# Altium schematic sheet Sheet1.SchDoc: USB C current mode supply from 12V battery
size 431 x 279 mm; Revision: 1.0.0; SheetNumber: 1; SheetTotal: 1; ENG_APP_DATE: --/--/--; DSN_APP_DATE: --/--/--; CHK_APP_DATE: --/--/--
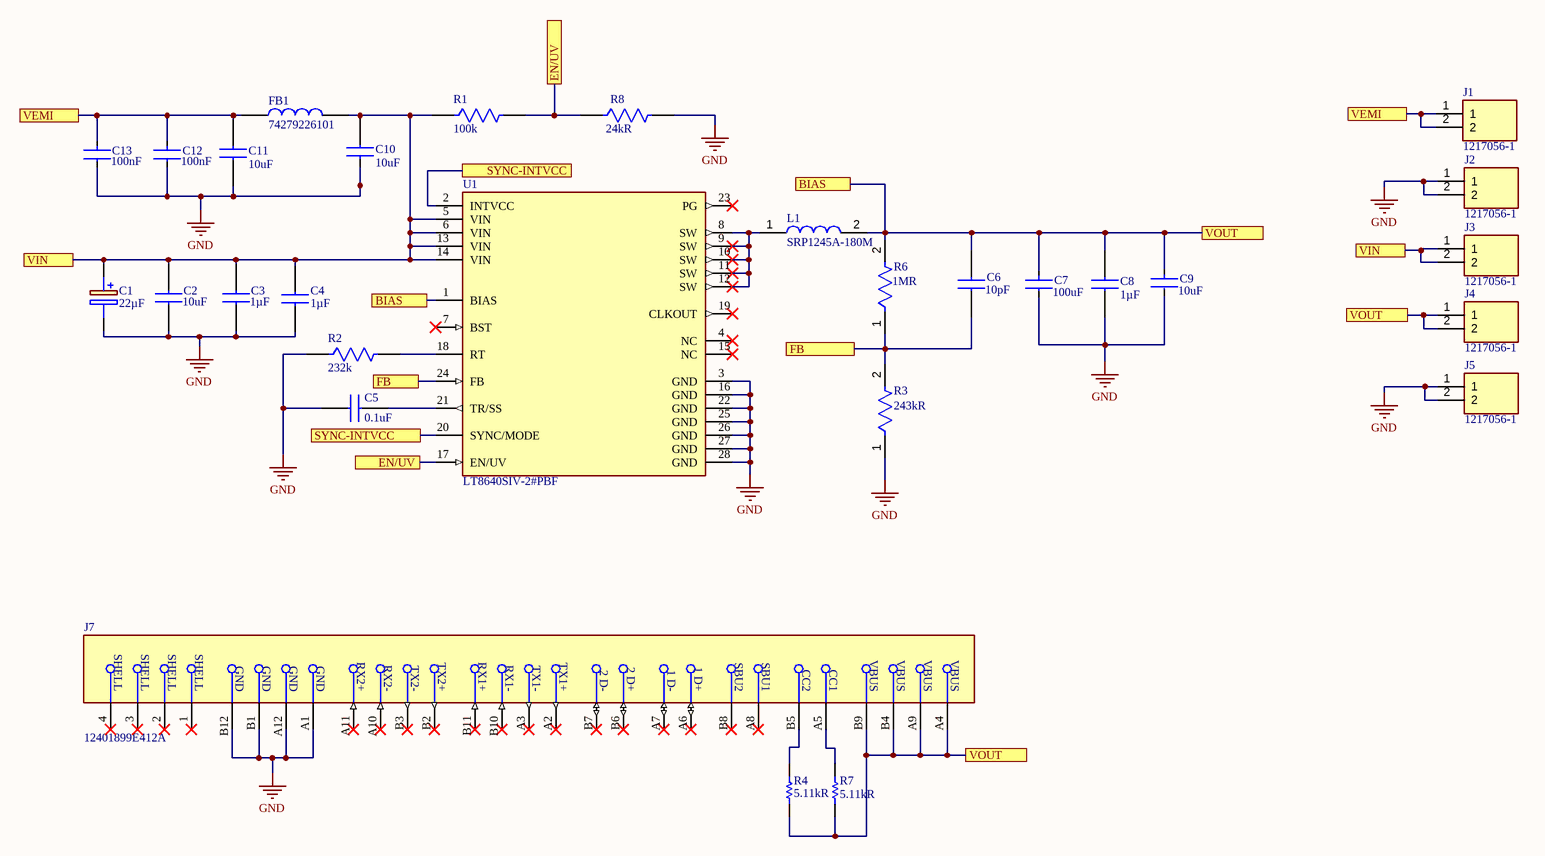
[diagram p0: Sheet1.SchDoc]

## Parts
C1  value 22µF  [CAPAE660X800N]  (hidden comment: 875585845002)
C2  value 10uF  [CAPC4532X280N]  (hidden comment: KGM43JR71H106KV)
C3  value 1µF  [CAPC1608X90N]  (hidden comment: 06035D105KAT2A)
C4  value 1µF  [CAPC1608X90N]  (hidden comment: 06035D105KAT2A)
C5  value 0.1uF  [CAPC1608X90N]  (hidden comment: 0603YC104K4T4A)
C6  value 10pF  [CAPC1608X90N]  (hidden comment: 06035U100JAT2A)
C7  Capacitance: 100uF  [FP-GRM32E-0_3-0_2-IPC_B]  (hidden comment: GRM32ER61A107ME20L)
C8  value 1µF  [CAPC1608X95N]  (hidden comment: KGM15BR71A105KT)
C9  Capacitance: 10uF  [FP-GRM188-0_2-MFG]  (hidden comment: GRM188R61E106MA73D)
C10  value 10uF  [CAPC3325X280N]  (hidden comment: KAM32LR71H106KL)
C11  value 10uF  [CAPC3325X280N]  (hidden comment: KAM32LR71H106KL)
C12  Capacitance: 100nF  [FP-GRM155-0_05-IPC_B]  (hidden comment: GRM155R71H104KE14D)
C13  Capacitance: 100nF  [FP-GRM155-0_05-IPC_B]  (hidden comment: GRM155R71H104KE14D)
FB1  74279226101  [WE-MPSB_181252]
J1  1217056-1  [12170561]
J2  1217056-1  [12170561]
J3  1217056-1  [12170561]
J4  1217056-1  [12170561]
J5  1217056-1  [12170561]
J7  12401899E412A  [FP-12401899E412A-MFG]
L1  SRP1245A-180M  [INDPM135125X500N]
R1  value 100k  [RESC1608X50N]  (hidden comment: CRCW0603100KFKEA)
R2  value 232k  [RESC1608X50N]  (hidden comment: CRCW0603232KFKEA)
R3  Resistance: 243kR  [FP-CRCW0603-HPe3-IPC_C]  (hidden comment: CRCW0603243KFKEAHP)
R4  value 5.11kR  [RESC1609X50X30NL10T20]  (hidden comment: CRCW06035K11FKTA)
R6  Resistance: 1MR  [FP-CRCW0603-e3-MFG]  (hidden comment: CRCW06031M00FKEA)
R7  value 5.11kR  [RESC1609X50X30NL10T20]  (hidden comment: CRCW06035K11FKTA)
R8  Resistance: 24kR  [FP-ESR03-MFG]  (hidden comment: ESR03EZPJ243)
U1  LT8640SIV-2#PBF  [FP-LQFN-24-05-08-1511-MFG]

## Ports
BIAS, EN/UV, FB, SYNC-INTVCC, VEMI, VIN, VOUT

## Nets
GND: C1.2(-) C2.1 C3.1 C4.1 C5.2 C7.2 C8.1 C9.2 C10.1 C11.1 C12.2 C13.2 J2.1 J2.2 J5.1 J5.2 J7.A1(GND) J7.A12(GND) J7.B1(GND) J7.B12(GND) R2.1 R3.1 R8.2 U1.3(GND) U1.16(GND) U1.22(GND) U1.25(GND) U1.26(GND) U1.27(GND) U1.28(GND)
BIAS: C6.2 C7.1 C8.2 C9.1 J4.1 J4.2 J7.A4(VBUS) J7.A9(VBUS) J7.B4(VBUS) J7.B9(VBUS) L1.2 R4.1 R6.2 R7.1 U1.1(BIAS) ; port BIAS, port VOUT
EN/UV: R1.2 R8.1 U1.17(EN/UV) ; port EN/UV
FB: C6.1 R3.2 R6.1 U1.24(FB) ; port FB
SYNC-INTVCC: U1.2(INTVCC) U1.20(SYNC/MODE) ; port SYNC-INTVCC
VEMI: C11.2 C12.1 C13.1 FB1.1 J1.1 J1.2 ; port VEMI
VIN: C1.1(+) C2.2 C3.2 C4.2 C10.2 FB1.2 J3.1 J3.2 R1.1 U1.5(VIN) U1.6(VIN) U1.13(VIN) U1.14(VIN) ; port VIN
NetC5_1: C5.1 U1.21(TR/SS)
NetJ7_A5: J7.A5(CC1) R7.2
NetJ7_B5: J7.B5(CC2) R4.2
NetL1_1: L1.1 U1.8(SW) U1.9(SW) U1.10(SW) U1.11(SW) U1.12(SW)
NetR2_2: R2.2 U1.18(RT)

Not connected (* = marked no-connect by the designer): J7 1(SHELL)* 2(SHELL)* 3(SHELL)* 4(SHELL)* A2(TX1+)* A3(TX1-)* A6(1_D+)* A7(1_D-)* A8(SBU1)* A10(RX2-)* A11(RX2+)* B2(TX2+)* B3(TX2-)* B6(2_D+)* B7(2_D-)* B8(SBU2)* B10(RX1-)* B11(RX1+)*; U1 4(NC)* 7(BST)* 15(NC)* 19(CLKOUT)* 23(PG)*

## Notes on the sheet
- DWG. NO.
- REV.
- SHT.
- THIS DOCUMENT AND THE DATA DISCLOSED HEREIN OR HEREWITH IS THE PROPERTY OF ALTIUM LIMITED AND MAY BE FREELY DISTRIBUTED IN WHOLE. NO RIGHTS ARE RESERVED OR EXPRESS OR IMPLIED WARANTEE GIVEN.
- REVISION
- DESCRIPTION
- DATE
- APPROVED
- ENG:
- APPROVALS
- PROJECT
- DSN:
- CHK:
- REFERENCE DOCUMENTS
- PROJECT REVISION:
- TITLE
- DOCUMENT REVISION:
- DESIGN ITEM:
- BOM:
- FAB DWG:
- PCB DWG:
- ASSY DWG:
- SCALE:
- SIZE
- B
- CAGE CODE
- FILE NAME
- DWG NO.
- SHEET
- OF
- REV

## Library data of the parts
C1 = 875585845002: Capacitor Polarised; Manufacturer_Name: Wurth Elektronik; Datasheet Link: https://www.we-online.com/components/products/datasheet/875585845002.pdf; Height: 8mm; Manufacturer_Part_Number: 875585845002; Mouser Part Number: 710-875585845002; Mouser Price/Stock: https://www.mouser.co.uk/ProductDetail/Wurth-Elektronik/875585845002?qs=9vOqFld9vZXZunBiCR9wnA%3D%3D
C2 = KGM43JR71H106KV: Capacitor; Manufacturer_Name: Kyocera AVX; Datasheet Link: https://datasheets.kyocera-avx.com/KGM_X7R.pdf; Height: 2.8mm; Manufacturer_Part_Number: KGM43JR71H106KV; Mouser Part Number: 581-KGM43JR71H106KV; Mouser Price/Stock: https://www.mouser.co.uk/ProductDetail/KYOCERA-AVX/KGM43JR71H106KV?qs=Jm2GQyTW%2FbgbK3VIRNTnpg%3D%3D
C3 C4 = 06035D105KAT2A: Capacitor; Manufacturer_Name: Kyocera AVX; Datasheet Link: https://componentsearchengine.com/Datasheets/1/06031A100FAT2A.pdf; Height: 0.9mm; Manufacturer_Part_Number: 06035D105KAT2A; Mouser Part Number: 581-06035D105KAT2A; Mouser Price/Stock: https://www.mouser.co.uk/ProductDetail/AVX/06035D105KAT2A?qs=jHkklCh7amj4RS3QGB%2FJvQ%3D%3D; Arrow Part Number: 06035D105KAT2A; Arrow Price/Stock: https://www.arrow.com/en/products/06035d105kat2a/avx
C5 = 0603YC104K4T4A: Capacitor; Manufacturer_Name: Kyocera AVX; Datasheet Link: https://componentsearchengine.com/Datasheets/1/06031A100FAT2A.pdf; Height: 0.9mm; Manufacturer_Part_Number: 0603YC104K4T4A; Mouser Part Number: 581-0603YC104K4T4A; Mouser Price/Stock: https://www.mouser.co.uk/ProductDetail/KYOCERA-AVX/0603YC104K4T4A?qs=Cej1j9ztgjEkPqVJkA4Bng%3D%3D; Arrow Part Number: 0603YC104K4T4A; Arrow Price/Stock: https://www.arrow.com/en/products/0603yc104k4t4a/avx?utm_currency=USD&region=nac
C6 = 06035U100JAT2A: Capacitor; Manufacturer_Name: Kyocera AVX; Datasheet Link: https://componentsearchengine.com/Datasheets/1/06031A100FAT2A.pdf; Height: 0.9mm; Manufacturer_Part_Number: 06035U100JAT2A
C7 = CMP-06035-048205-1: Chip Multilayer Ceramic Capacitors for General Purpose, 1210, 100uF, X5R, 15%, 20%, 10V; Dissipation Factor: 0.035%; Packaging: Tape and Reel; Width: 2.5mm; Case/Package: 1210; Min Operating Temperature: -55°C; Depth: 2.5mm; Package Quantity: 1000; Case Code (Imperial): 1210; Voltage Rating: 10V; Dielectric Material: Ceramic; Length: 3.2mm; Lead Free: Lead Free; REACH SVHC: No SVHC; Mount: Surface Mount; Height: 2.5mm; Voltage Rating (DC): 10V; Dielectric: X5R; Thickness: 0.106inch; Weight: 0.00388oz; Material: Ceramic; Termination: SMD/SMT; Tolerance: 20%; Case Code (Metric): 3225; Voltage: 10V; Max Operating Temperature: 85°C
C8 = KGM15BR71A105KT: Capacitor; Manufacturer_Name: Kyocera AVX; Datasheet Link: https://datasheets.kyocera-avx.com/KGM_X7R.pdf; Height: 0.95mm; Manufacturer_Part_Number: KGM15BR71A105KT
C9 = CMP-2006-02520-2: Chip Multilayer Ceramic Capacitors for General Purpose, 0603, 10uF, X5R, 15%, 20%, 25V; Tolerance: 20%; Resistor Type: Ceramic; Voltage: 25V; Max Operating Temperature: 85°C; Min Operating Temperature: -55°C; Dielectric: X5R; Lead Free: Lead Free; REACH SVHC: No SVHC; Case/Package: 0603; Mount: Surface Mount; Voltage Rating (DC): 25V; Height: 0.8mm; Length: 1.6mm; Thickness: 0.031inch; Width: 0.031inch; Termination: SMD/SMT; Case Code (Imperial): 0603; Case Code (Metric): 1608; Package Quantity: 1; Packaging: Tape and Reel; Depth: 0.8mm; Voltage Rating: 25V; Weight: 0.000222oz; Number of Pins: 2
C10 C11 = KAM32LR71H106KL: Capacitor; Manufacturer_Name: Kyocera AVX; Datasheet Link: https://spicat.kyocera-avx.com/product/KAM32LR71H106KL; Height: 2.8mm; Manufacturer_Part_Number: KAM32LR71H106KL; Mouser Part Number: 581-KAM32LR71H106KL; Mouser Price/Stock: https://www.mouser.co.uk/ProductDetail/KYOCERA-AVX/KAM32LR71H106KL?qs=Jm2GQyTW%2FbgMjBEJHOJ9ig%3D%3D
C12 C13 = CMP-2008-04639-2: Chip Multilayer Ceramic Capacitors for General Purpose, 0402, 0.10uF, X7R, 15%, 10%, 50V; Dissipation Factor: 0.025%; Weight: 0.000212oz; Thickness: 0.022inch; Voltage Rating (DC): 50V; Dielectric Material: Ceramic; Termination: SMD/SMT; Case/Package: 0402; Case Code (Imperial): 0402; Mount: Surface Mount; REACH SVHC: No SVHC; Resistor Type: Ceramic; Dielectric: X7R; Max Operating Temperature: 125°C; Voltage: 50V; Lead Free: Lead Free; Package Quantity: 10000; Packaging: Tape and Reel; Length: 1mm; Material: Ceramic; Height: 0.5mm; Depth: 0.5mm; Width: 0.5mm; Min Operating Temperature: -55°C; Tolerance: 10%; Case Code (Metric): 1005; Voltage Rating: 50V
FB1 = 74279226101: Inductor; Manufacturer_Name: Wurth Elektronik; Datasheet Link: http://componentsearchengine.com/Datasheets/1/74279226101.pdf; Manufacturer_Part_Number: 74279226101; Mouser Part Number: 710-74279226101; Mouser Price/Stock: https://www.mouser.co.uk/ProductDetail/Wurth-Elektronik/74279226101?qs=cFlH0mFHHFoXMLq8ANMOrg%3D%3D
J1-J5 = 1217056-1: Connector; Manufacturer_Name: TE Connectivity; Datasheet Link: https://www.te.com/commerce/DocumentDelivery/DDEController?Action=srchrtrv&DocNm=82159_PCB_TERMINALS_AND_DISCONNECTS&DocType=Catalog%20Section&DocLang=English&PartCntxt=1217056-1&DocFormat=pdf; Height: 13mm; Manufacturer_Part_Number: 1217056-1; Mouser Part Number: 571-1217056-1; Mouser Price/Stock: https://www.mouser.co.uk/ProductDetail/TE-Connectivity-AMP/1217056-1?qs=yW2XQG1Ii9EcBJhZ77Yj5A%3D%3D; Arrow Part Number: 1217056-1; Arrow Price/Stock: https://www.arrow.com/en/products/1217056-1/te-connectivity?utm_currency=USD&region=europe
J7 = CMP-02355-000006-1: USB TYPE C, RECEPTACLE, TOP MOUN
L1 = SRP1245A-180M: Inductor; Manufacturer_Name: Bourns; Datasheet Link: https://www.bourns.com/docs/Product-Datasheets/SRP1245A.pdf; Height: 5mm; Manufacturer_Part_Number: SRP1245A-180M; Mouser Part Number: 652-SRP1245A-180M; Mouser Price/Stock: https://www.mouser.co.uk/ProductDetail/Bourns/SRP1245A-180M?qs=7z%252BmIopC6%2FJMVrKhbhk5JQ%3D%3D; Arrow Part Number: SRP1245A-180M; Arrow Price/Stock: https://www.arrow.com/en/products/srp1245a-180m/bourns?region=europe
R1 = CRCW0603100KFKEA: Resistor; Manufacturer_Name: Vishay; Datasheet Link: http://www.vishay.com/docs/20035/dcrcwe3.pdf; Height: 0.5mm; Manufacturer_Part_Number: CRCW0603100KFKEA; Mouser Part Number: 71-CRCW0603-100K-E3; Mouser Price/Stock: https://www.mouser.co.uk/ProductDetail/Vishay-Dale/CRCW0603100KFKEA?qs=6dqgS%252BKntICWHMMdIzt5%2FQ%3D%3D; Arrow Part Number: CRCW0603100KFKEA; Arrow Price/Stock: https://www.arrow.com/en/products/crcw0603100kfkea/vishay?utm_currency=USD&region=nac
R2 = CRCW0603232KFKEA: Resistor; Manufacturer_Name: Vishay; Datasheet Link: http://www.vishay.com/docs/20035/dcrcwe3.pdf; Height: 0.5mm; Manufacturer_Part_Number: CRCW0603232KFKEA; Mouser Part Number: 71-CRCW0603-232K-E3; Mouser Price/Stock: https://www.mouser.co.uk/ProductDetail/Vishay-Dale/CRCW0603232KFKEA?qs=NHKSztHah43mx5UrSmXOxA%3D%3D; Arrow Part Number: CRCW0603232KFKEA; Arrow Price/Stock: https://www.arrow.com/en/products/crcw0603232kfkea/vishay
R3 = CMP-02407-012113-1: RES Thick Film, 243kΩ, 1%, 0.33W, 100ppm/°C, 0603; Max Power Dissipation: 250mW; Case/Package: 0603; Min Operating Temperature: -55°C; Series: CRCW-HP; Resistor Type: Thick Film; Features: Automotive AEC-Q200; Number of Terminations: 2; Packaging: Tape and Reel; Lead Free: Lead Free; Max Operating Temperature: 155°C; Temperature Coefficient: 100ppm/°C; Width: 0.033inch; RoHS Compliant: Yes; Package Quantity: 5000; Tolerance: 1%; Height: 0.022inch; Length: 0.063inch
R4 R7 = CMP-2000-03483-1: Manufacturer: Vishay Dale; Part Number: CRCW06035K11FKTA
R6 = CMP-2000-03013-2: RES Thick Film, 1MΩ, 1%, 0.1W, 100ppm/°C, 0603; Max Power Dissipation: 100mW; Voltage Rating (DC): 75V; Depth: 0.85mm; Max Operating Temperature: 155°C; Length: 1.55mm; Power Rating: 100mW; Military Standard: Not; Features: Automotive AEC-Q200; Min Operating Temperature: -55°C; Number of Pins: 2; Mount: Surface Mount; Package Quantity: 10; Packaging: Tape and Reel; Height: 0.45mm; Radiation Hardening: No; Case Code (Metric): 1608; Temperature Coefficient: 100ppm/°C; Width: 0.85mm; Composition: Thick Film; Termination: SMD/SMT; Tolerance: 1%; Number of Terminations: 2; Lead Free: Lead Free; Contact Plating: Tin; Case/Package: 0603; Weight: 7.1E-05oz; Voltage Rating: 75V; Case Code (Imperial): 0603
R8 = CMP-08839-007552-1: 24kΩ ±5% 0.25W 0603 Anti-Surge Chip Resistor AEC-Q200; Max Power Dissipation: 250mW; Temperature Coefficient: 200ppm/°C; Features: Automotive AEC-Q200; Package Quantity: 5000; RoHS Compliant: Yes; Width: 0.031inch; Packaging: Tape and Reel; Length: 0.063inch; Case/Package: 0603; Series: ESR; Resistor Type: Thick Film; Number of Terminations: 2; Max Operating Temperature: 155°C; Height: 0.022inch; Case Code (Metric): 1608; Tolerance: 5%; Min Operating Temperature: -55°C; Case Code (Imperial): 0603
U1 = CMP-09139-000228-1: IC REG BUCK ADJUSTABLE 6A 24LQFN; RoHS Compliant: Yes